# EAGLE schematic Dual (EAGLE 9.6.2)
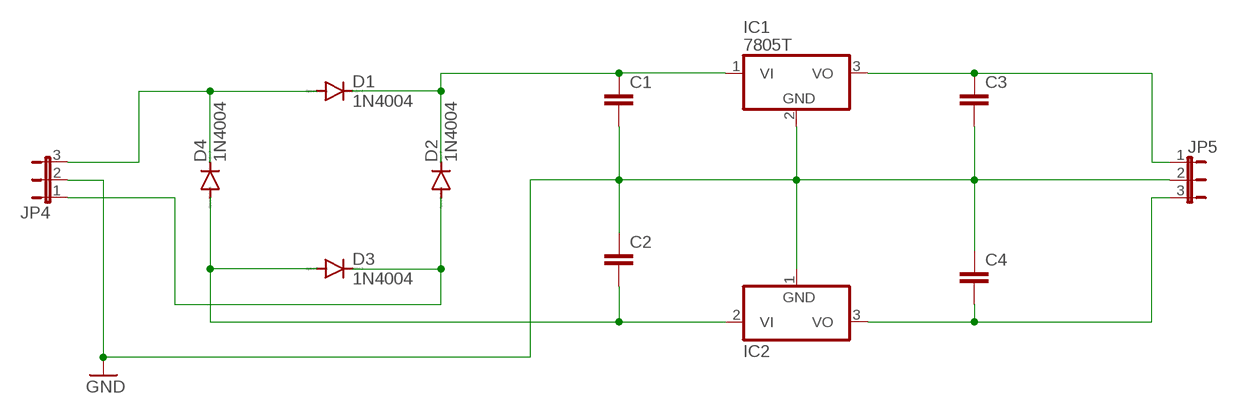
[diagram p0: schematic, sheet 1]

## Parts
C1  C2,5-3  [C2.5-3]
C2  C2,5-3  [C2.5-3]
C3  C2,5-3  [C2.5-3]
C4  C2,5-3  [C2.5-3]
D1  1N4004  [DO41-10]
D2  1N4004  [DO41-10]
D3  1N4004  [DO41-10]
D4  1N4004  [DO41-10]
IC1  7805T  [TO220H]
IC2  7905T  [TO220H]
JP4  JP2W  [JP2W]
JP5  JP2W  [JP2W]

## Nets
GND: C1.2 C2.1 C3.2 C4.1 IC1.2(GND) IC2.1(GND) JP4.2 JP5.2
N$1: D1.A D4.C JP4.3
N$2: C2.2 D3.A D4.A IC2.2(VI)
N$3: D2.A D3.C JP4.1
N$4: C1.1 D1.C D2.C IC1.1(VI)
N$6: C4.2 IC2.3(VO) JP5.3
N$9: C3.1 IC1.3(VO) JP5.1

## Library data of the parts
C1-C4 = capacitor-wima:C: CAPACITOR naming: grid - package width
D1-D4 = diode:1N4004: DIODE general purpose rectifier, 1 A
IC1 = linear:78*: Positive VOLTAGE REGULATOR Source: http://cache.national.com/ds/LM/LM78L05.pdf http://www.fairchildsemi.com/ds/LM/LM7805.pdf
IC2 = linear:79*: Negative VOLTAGE REGULATOR
JP4 JP5 = jumper:JP2W: JUMPER